# Altium schematic sheet Sheet1.SchDoc
size A4
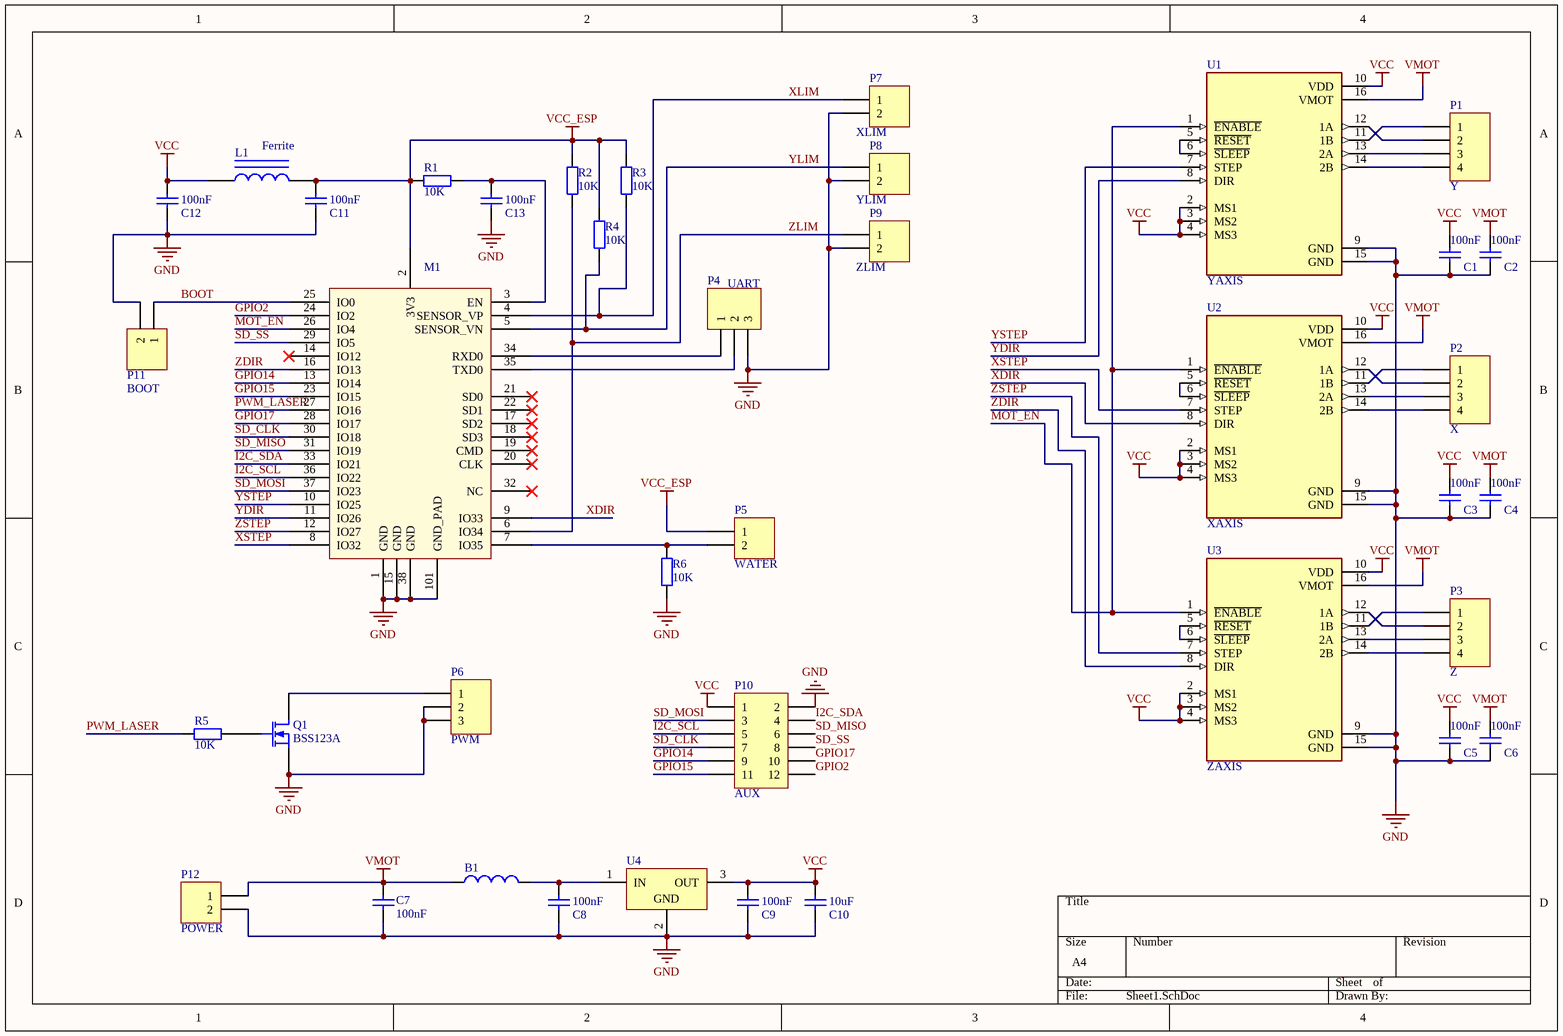
[diagram p0: Sheet1.SchDoc]

## Parts
B1  Ferrite  [INDC3225N]  (value not drawn)
C1  value 100nF  [0805]  (hidden comment: Cap Semi)
C2  value 100nF  [0805]  (hidden comment: Cap Semi)
C3  value 100nF  [0805]  (hidden comment: Cap Semi)
C4  value 100nF  [0805]  (hidden comment: Cap Semi)
C5  value 100nF  [0805]  (hidden comment: Cap Semi)
C6  value 100nF  [0805]  (hidden comment: Cap Semi)
C7  value 100nF  [0805]  (hidden comment: Cap Semi)
C8  value 100nF  [0805]  (hidden comment: Cap Semi)
C9  value 100nF  [0805]  (hidden comment: Cap Semi)
C10  value 10uF  [1210]  (hidden comment: Cap Semi)
C11  value 100nF  [0805]  (hidden comment: Cap Semi)
C12  value 100nF  [0805]  (hidden comment: Cap Semi)
C13  value 100nF  [0805]  (hidden comment: Cap Semi)
L1  Ferrite  [INDC2012N]
M1  ESP32S_Module  [ESP32S]  (value not drawn)
P1  Y  [HDR1X4]
P2  X  [HDR1X4]
P3  Z  [HDR1X4]
P4  UART  [HDR1X3]
P5  WATER  [HDR1X2]
P6  PWM  [HDR1X3]
P7  XLIM  [HDR1X2]
P8  YLIM  [HDR1X2]
P9  ZLIM  [HDR1X2]
P10  AUX  [HDR2X6]
P11  BOOT  [HDR1X2]
P12  POWER  [HDR1X2]
Q1  BSS123A  [SOT23_M]
R1  value 10K  [0805]  (hidden comment: Res2)
R2  value 10K  [0805]  (hidden comment: Res2)
R3  value 10K  [0805]  (hidden comment: Res2)
R4  value 10K  [0805]  (hidden comment: Res2)
R5  value 10K  [0805]  (hidden comment: Res2)
R6  value 10K  [0805]  (hidden comment: Res2)
U1  YAXIS  [MODULE_A4988_STEPPER_MOTOR_DRIVER_CARRIER]
U2  XAXIS  [MODULE_A4988_STEPPER_MOTOR_DRIVER_CARRIER]
U3  ZAXIS  [MODULE_A4988_STEPPER_MOTOR_DRIVER_CARRIER]
U4  3V3REG  [TRS1-24xx]  (value not drawn)

## Nets
GND: C1.2 C2.2 C3.2 C4.2 C5.2 C6.2 C7.1 C8.2 C9.2 C10.2 C11.2 C12.2 C13.2 M1.1(GND) M1.15(GND) M1.38(GND) M1.101(GND_PAD) P4.3 P6.2 P6.3 P7.2 P8.2 P9.2 P10.2 P11.2 P12.2 Q1.2(S) R6.2 U1.9(GND) U1.15(GND) U2.9(GND) U2.15(GND) U3.9(GND) U3.15(GND) U4.2(GND)
VCC: C1.1 C3.1 C5.1 C9.1 C10.1 C12.1 L1.1 P10.1 U1.2(MS1) U1.3(MS2) U1.4(MS3) U1.10(VDD) U2.2(MS1) U2.3(MS2) U2.4(MS3) U2.10(VDD) U3.2(MS1) U3.3(MS2) U3.4(MS3) U3.10(VDD) U4.3(OUT)
VCC_ESP: C11.1 L1.2 M1.2(3V3) P5.1 R1.2 R2.1 R3.1 R4.1
VMOT: B1.1 C2.1 C4.1 C6.1 C7.2 P12.1 U1.16(VMOT) U2.16(VMOT) U3.16(VMOT)
BOOT: M1.25(IO0) P11.1
GPIO2: M1.24(IO2) P10.12
GPIO14: M1.13(IO14) P10.9
GPIO15: M1.23(IO15) P10.11
GPIO17: M1.28(IO17) P10.10
I2C_SCL: M1.36(IO22) P10.5
I2C_SDA: M1.33(IO21) P10.4
MOT_EN: M1.26(IO4) U1.1(~{ENABLE}) U2.1(~{ENABLE}) U3.1(~{ENABLE})
PWM_LASER: M1.27(IO16) R5.1
SD_CLK: M1.30(IO18) P10.7
SD_MISO: M1.31(IO19) P10.6
SD_MOSI: M1.37(IO23) P10.3
SD_SS: M1.29(IO5) P10.8
XDIR: M1.9(IO33) U2.8(DIR)
XLIM: M1.4(SENSOR_VP) P7.1 R3.2
XSTEP: M1.8(IO32) U2.7(STEP)
YDIR: M1.11(IO26) U1.8(DIR)
YLIM: M1.5(SENSOR_VN) P8.1 R4.2
YSTEP: M1.10(IO25) U1.7(STEP)
ZDIR: M1.16(IO13) U3.8(DIR)
ZLIM: M1.6(IO34) P9.1 R2.2
ZSTEP: M1.12(IO27) U3.7(STEP)
NetB1_2: B1.2 C8.1 U4.1(IN)
NetC13_1: C13.1 M1.3(EN) R1.1
NetM1_7: M1.7(IO35) P5.2 R6.1
NetM1_34: M1.34(RXD0) P4.1
NetM1_35: M1.35(TXD0) P4.2
NetP1_1: P1.1 U1.11(1B)
NetP1_2: P1.2 U1.12(1A)
NetP1_3: P1.3 U1.13(2A)
NetP1_4: P1.4 U1.14(2B)
NetP2_1: P2.1 U2.11(1B)
NetP2_2: P2.2 U2.12(1A)
NetP2_3: P2.3 U2.13(2A)
NetP2_4: P2.4 U2.14(2B)
NetP3_1: P3.1 U3.11(1B)
NetP3_2: P3.2 U3.12(1A)
NetP3_3: P3.3 U3.13(2A)
NetP3_4: P3.4 U3.14(2B)
NetP6_1: P6.1 Q1.1(D)
NetQ1_3: Q1.3(G) R5.2
NetU1_5: U1.5(~{RESET}) U1.6(~{SLEEP})
NetU2_5: U2.5(~{RESET}) U2.6(~{SLEEP})
NetU3_5: U3.5(~{RESET}) U3.6(~{SLEEP})

Not connected (* = marked no-connect by the designer): M1 14(IO12)* 17(SD2)* 18(SD3)* 19(CMD)* 20(CLK)* 21(SD0)* 22(SD1)* 32(NC)*

## Library data of the parts
B1 = Inductor: Manufacturer: Murata; Manufacturer ref: BLM31P121; Conti: 1; Revision: July-2002: Re-released for DXP Platform.; Supplier: Farnell; Supplier 2: Continental; Supplier ref: 5807293; Supplier ref 2: A2C00008628
C1-C6 C8 C9 C11-C13 = Cap Semi: Capacitor (Semiconductor SIM Model); Manufacturer: Generic Components; Voltage: 50V; Conti: 67; Revision: July-2002: Re-released for DXP Platform.; Supplier: Continental; Supplier ref: A2C00046692
C7 = Cap Semi: Capacitor (Semiconductor SIM Model); Manufacturer: Generic Components; Voltage: 50V; Conti: 30; Revision: July-2002: Re-released for DXP Platform.; Supplier: Continental; Supplier ref: A2C00046692
C10 = Cap Semi: Capacitor (Semiconductor SIM Model); Manufacturer: Generic Components; Voltage: 25V; Conti: 47; Revision: July-2002: Re-released for DXP Platform.; Supplier: Continental; Supplier ref: A2C00038896
L1 = Inductor Iron: Magnetic-Core Inductor; Manufacturer: Murata; Manufacturer ref: BLM21P221S; Conti: 105; Supplier: Continental; Supplier ref: A2C00011506
M1 = ESP32S_Module: Esp-32S; Datasheet: https://espressif.com/sites/default/files/documentation/esp_wroom_32_datasheet_en.pdf
P1-P3 = Header 4: Header, 4-Pin; LatestRevisionDate: 17-Jul-2002; LatestRevisionNote: Re-released for DXP Platform.; Publisher: Altium Limited
P4 P6 = Header 3: Header, 3-Pin; LatestRevisionDate: 17-Jul-2002; LatestRevisionNote: Re-released for DXP Platform.; Publisher: Altium Limited
P5 P7-P9 P11 P12 = Header 2: Header, 2-Pin; LatestRevisionDate: 17-Jul-2002; LatestRevisionNote: Re-released for DXP Platform.; Publisher: Altium Limited
P10 = Header 6X2: Header, 6-Pin, Dual row; LatestRevisionDate: 17-Jul-2002; LatestRevisionNote: Re-released for DXP Platform.; Publisher: Altium Limited
Q1 = BSS123A: N-Channel Enhancement Mode Vertical DMOS FET; Published: 17-Dec-2003; DatasheetVersion: Apr-98; PackageVersion: 1996; PackageReference: SOT23; Publisher: Altium Limited; PackageDescription: SOT-23; 3 Leads; Body 3.1 x 2.5 mm, inc. leads (LxW max), Alternate Lead Configuration; ComponentLink1Description: Manufacturer Link; ComponentLink1URL: http://www.zetex.com/; ComponentLink2Description: Datasheet; ComponentLink2URL: www.zetex.com/3.0/pdf/BS123A.pdf
R1-R6 = Res2: Resistor; Manufacturer: Generic Components; Conti: 239; Revision: July-2002: Re-released for DXP Platform.
U1-U3 = A4988_STEPPER_MOTOR_DRIVER_CARRIER: Stepper Motor Driver; MP: A4988 STEPPER MOTOR DRIVER CARRIER; MF: Pololu; Availability: Unavailable; Price: None; Package: None; Value: *; SnapEDA_Link: https://www.snapeda.com/parts/A4988%20STEPPER%20MOTOR%20DRIVER%20CARRIER/Pololu/view-part/1499394/?ref=snap
U4 = TSR1-2433: Switching Regulator,18-32Vin,3.3Vout 1A; Manufacture: Traco; Manufacture Ref: TSR1-2450; LastRevisionNote: Release; LastRevisionDate: 10-Jan-2012; Supplier Ref: 666-4360; Supplier: RS; Price: 8,04